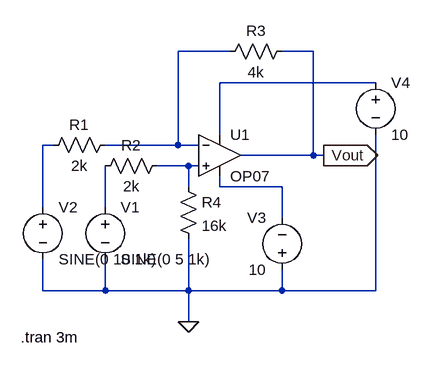
[diagram p0: schematic Differential Amplifier.asc]
Differential Amplifier.asc, the LTspice schematic file:
Version 4
SHEET 1 880 680
WIRE 208 -16 128 -16
WIRE 336 -16 288 -16
WIRE 432 32 192 32
WIRE 192 112 192 32
WIRE -64 128 -80 128
WIRE 128 128 128 -16
WIRE 128 128 16 128
WIRE 160 128 128 128
WIRE 336 144 336 -16
WIRE 336 144 224 144
WIRE 352 144 336 144
WIRE 144 160 96 160
WIRE 160 160 144 160
WIRE 144 192 144 160
WIRE 192 192 192 176
WIRE 288 192 192 192
WIRE -80 224 -80 128
WIRE 16 224 16 160
WIRE 288 240 288 192
WIRE -80 352 -80 304
WIRE 16 352 16 304
WIRE 16 352 -80 352
WIRE 144 352 144 272
WIRE 144 352 16 352
WIRE 288 352 288 320
WIRE 288 352 144 352
WIRE 432 352 432 112
WIRE 432 352 288 352
WIRE 144 400 144 352
FLAG 144 400 0
FLAG 352 144 Vout
IOPIN 352 144 Out
SYMBOL OpAmps\\OP07 192 80 R0
SYMATTR InstName U1
SYMBOL res 32 112 R90
WINDOW 0 0 56 VBottom 2
WINDOW 3 32 56 VTop 2
SYMATTR InstName R1
SYMATTR Value 2k
SYMBOL res 112 144 R90
WINDOW 0 0 56 VBottom 2
WINDOW 3 32 56 VTop 2
SYMATTR InstName R2
SYMATTR Value 2k
SYMBOL voltage 16 208 R0
WINDOW 123 0 0 Left 0
WINDOW 39 0 0 Left 0
SYMATTR InstName V1
SYMATTR Value SINE(0 5 1k)
SYMBOL voltage -80 208 R0
WINDOW 123 0 0 Left 0
WINDOW 39 0 0 Left 0
SYMATTR InstName V2
SYMATTR Value SINE(0 10 1k)
SYMBOL res 304 -32 R90
WINDOW 0 0 56 VBottom 2
WINDOW 3 32 56 VTop 2
SYMATTR InstName R3
SYMATTR Value 4k
SYMBOL res 128 176 R0
SYMATTR InstName R4
SYMATTR Value 16k
SYMBOL voltage 288 336 R180
WINDOW 0 24 96 Left 2
WINDOW 3 24 16 Left 2
WINDOW 123 0 0 Left 0
WINDOW 39 0 0 Left 0
SYMATTR InstName V3
SYMATTR Value 10
SYMBOL voltage 432 16 R0
WINDOW 123 0 0 Left 0
WINDOW 39 0 0 Left 0
SYMATTR InstName V4
SYMATTR Value 10
TEXT -114 424 Left 2 !.tran 3m

The netlist it stands for:
* Differential Amplifier.asc
XU1 N004 N001 N002 N005 Vout LT1001  ; OP07, pins In+ In- V+ V- OUT
R1 N001 N003 2k
R2 N004 N006 2k
V1 N006 0 SINE(0 5 1k)
V2 N003 0 SINE(0 10 1k)
R3 Vout N001 4k
R4 N004 0 16k
V3 0 N005 10
V4 N002 0 10
.tran 3m
.lib LTC.lib
.backanno
.end